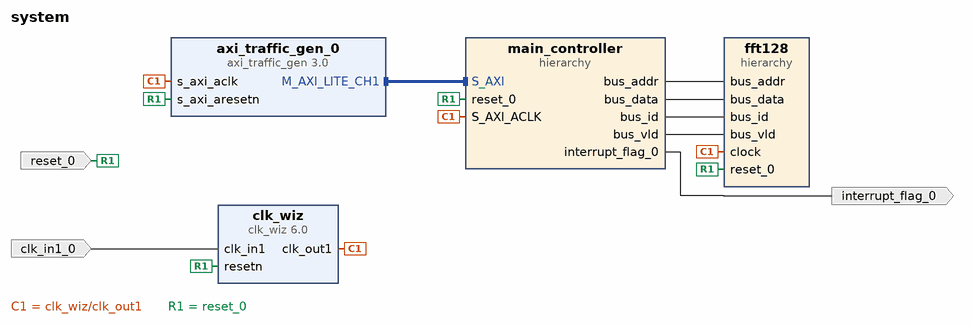
[diagram p0: block diagram of the top level]
# Vivado block design system, xc7z020clg484-1, Vivado 2018.3
create_bd_design system

create_bd_port -dir I -type rst reset_0
set_property -dict {CONFIG.POLARITY ACTIVE_LOW} [get_bd_ports reset_0]
create_bd_port -dir I -type clk clk_in1_0
create_bd_port -dir O interrupt_flag_0

create_bd_cell -type ip -vlnv xilinx.com:ip:axi_traffic_gen:3.0 axi_traffic_gen_0
set_property -dict [list \
  CONFIG.C_ATG_MIF_DATA_DEPTH 32 \
  CONFIG.C_ATG_MODE AXI4-Lite \
  CONFIG.C_ATG_SYSTEM_INIT_ADDR_MIF ../../../../../../../../mcs/coe/axi_lite_addr.coe \
  CONFIG.C_ATG_SYSTEM_INIT_DATA_MIF ../../../../../../../../mcs/coe/axi_lite_data.coe \
] [get_bd_cells axi_traffic_gen_0]
create_bd_cell -type ip -vlnv xilinx.com:ip:clk_wiz:6.0 clk_wiz
set_property -dict {CONFIG.RESET_PORT resetn CONFIG.RESET_TYPE ACTIVE_LOW} [get_bd_cells clk_wiz]
create_bd_cell -type hier fft128
create_bd_cell -type hier main_controller

# ---- hierarchy /fft128 ----
current_bd_instance /fft128
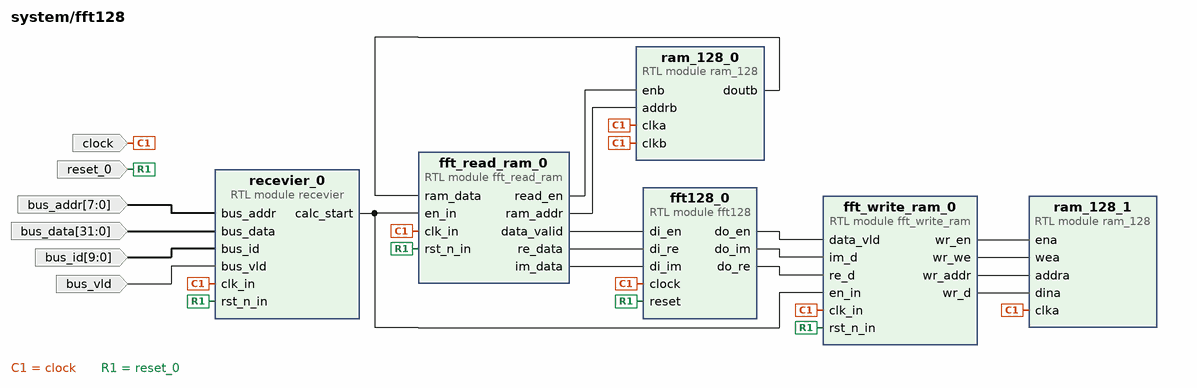
[diagram p1: block diagram inside /fft128]
create_bd_pin -dir I -type clk clock
create_bd_pin -dir I -type rst reset_0
create_bd_pin -dir I -from 7 -to 0 bus_addr
create_bd_pin -dir I -from 31 -to 0 bus_data
create_bd_pin -dir I -from 9 -to 0 bus_id
create_bd_pin -dir I bus_vld

create_bd_cell -type module -reference fft_read_ram fft_read_ram_0
set_property -dict {CONFIG.ARAMWIDTH 7} [get_bd_cells fft_read_ram_0]
create_bd_cell -type module -reference recevier recevier_0
create_bd_cell -type module -reference fft128 fft128_0
create_bd_cell -type module -reference fft_write_ram fft_write_ram_0
create_bd_cell -type module -reference ram_128 ram_128_0
create_bd_cell -type module -reference ram_128 ram_128_1

# ---- hierarchy /main_controller ----
current_bd_instance /main_controller
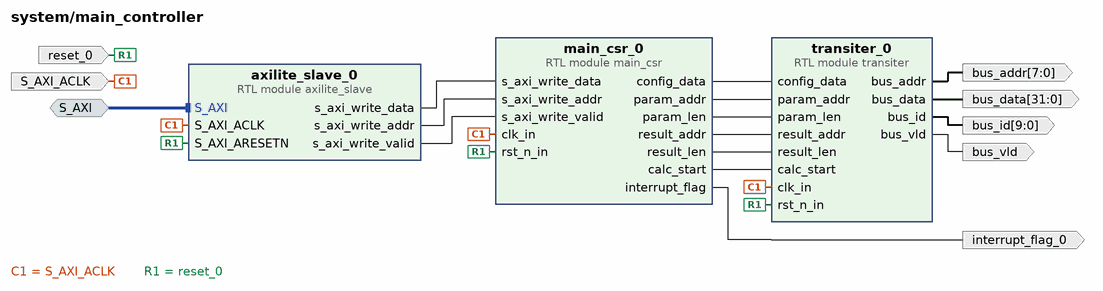
[diagram p2: block diagram inside /main_controller]
create_bd_intf_pin -mode Slave -vlnv xilinx.com:interface:aximm_rtl:1.0 S_AXI
create_bd_pin -dir I -type clk S_AXI_ACLK
create_bd_pin -dir I -type rst reset_0
create_bd_pin -dir O interrupt_flag_0
create_bd_pin -dir O -from 7 -to 0 bus_addr
create_bd_pin -dir O -from 31 -to 0 bus_data
create_bd_pin -dir O -from 9 -to 0 bus_id
create_bd_pin -dir O bus_vld

create_bd_cell -type module -reference axilite_slave axilite_slave_0
create_bd_cell -type module -reference main_csr main_csr_0
create_bd_cell -type module -reference transiter transiter_0

# ---- connections ----

current_bd_instance /fft128
connect_bd_net [get_bd_pins fft_write_ram_0/wr_en] [get_bd_pins ram_128_1/ena]
connect_bd_net [get_bd_pins fft_write_ram_0/wr_we] [get_bd_pins ram_128_1/wea]
connect_bd_net [get_bd_pins fft_write_ram_0/wr_addr] [get_bd_pins ram_128_1/addra]
connect_bd_net [get_bd_pins fft_write_ram_0/wr_d] [get_bd_pins ram_128_1/dina]
connect_bd_net [get_bd_pins fft128_0/do_en] [get_bd_pins fft_write_ram_0/data_vld]
connect_bd_net [get_bd_pins fft128_0/do_im] [get_bd_pins fft_write_ram_0/im_d]
connect_bd_net [get_bd_pins fft128_0/do_re] [get_bd_pins fft_write_ram_0/re_d]
connect_bd_net -net clk_wiz_clk_out1 [get_bd_pins clock] \
  [get_bd_pins fft_read_ram_0/clk_in] [get_bd_pins recevier_0/clk_in] [get_bd_pins fft128_0/clock] \
  [get_bd_pins fft_write_ram_0/clk_in] [get_bd_pins ram_128_0/clka] [get_bd_pins ram_128_0/clkb] [get_bd_pins ram_128_1/clka]
connect_bd_net [get_bd_pins fft_read_ram_0/data_valid] [get_bd_pins fft128_0/di_en]
connect_bd_net [get_bd_pins fft_read_ram_0/re_data] [get_bd_pins fft128_0/di_re]
connect_bd_net [get_bd_pins fft_read_ram_0/im_data] [get_bd_pins fft128_0/di_im]
connect_bd_net [get_bd_pins bus_addr] [get_bd_pins recevier_0/bus_addr]
connect_bd_net [get_bd_pins bus_data] [get_bd_pins recevier_0/bus_data]
connect_bd_net [get_bd_pins bus_id] [get_bd_pins recevier_0/bus_id]
connect_bd_net [get_bd_pins bus_vld] [get_bd_pins recevier_0/bus_vld]
connect_bd_net [get_bd_pins recevier_0/calc_start] [get_bd_pins fft_read_ram_0/en_in] [get_bd_pins fft_write_ram_0/en_in]
connect_bd_net -net reset_0_1 [get_bd_pins reset_0] \
  [get_bd_pins fft_read_ram_0/rst_n_in] [get_bd_pins recevier_0/rst_n_in] [get_bd_pins fft128_0/reset] \
  [get_bd_pins fft_write_ram_0/rst_n_in]
connect_bd_net [get_bd_pins fft_read_ram_0/read_en] [get_bd_pins ram_128_0/enb]
connect_bd_net [get_bd_pins fft_read_ram_0/ram_addr] [get_bd_pins ram_128_0/addrb]
connect_bd_net [get_bd_pins ram_128_0/doutb] [get_bd_pins fft_read_ram_0/ram_data]

current_bd_instance /main_controller
connect_bd_intf_net -intf_net axi_traffic_gen_0_M_AXI_LITE_CH1 [get_bd_intf_pins S_AXI] [get_bd_intf_pins axilite_slave_0/S_AXI]
connect_bd_net [get_bd_pins axilite_slave_0/s_axi_write_data] [get_bd_pins main_csr_0/s_axi_write_data]
connect_bd_net [get_bd_pins axilite_slave_0/s_axi_write_addr] [get_bd_pins main_csr_0/s_axi_write_addr]
connect_bd_net [get_bd_pins axilite_slave_0/s_axi_write_valid] [get_bd_pins main_csr_0/s_axi_write_valid]
connect_bd_net [get_bd_pins main_csr_0/config_data] [get_bd_pins transiter_0/config_data]
connect_bd_net [get_bd_pins main_csr_0/param_addr] [get_bd_pins transiter_0/param_addr]
connect_bd_net [get_bd_pins main_csr_0/param_len] [get_bd_pins transiter_0/param_len]
connect_bd_net [get_bd_pins main_csr_0/result_addr] [get_bd_pins transiter_0/result_addr]
connect_bd_net [get_bd_pins main_csr_0/result_len] [get_bd_pins transiter_0/result_len]
connect_bd_net [get_bd_pins main_csr_0/calc_start] [get_bd_pins transiter_0/calc_start]
connect_bd_net -net clk_wiz_clk_out1 [get_bd_pins S_AXI_ACLK] \
  [get_bd_pins axilite_slave_0/S_AXI_ACLK] [get_bd_pins main_csr_0/clk_in] [get_bd_pins transiter_0/clk_in]
connect_bd_net -net reset_0_1 [get_bd_pins reset_0] \
  [get_bd_pins axilite_slave_0/S_AXI_ARESETN] [get_bd_pins main_csr_0/rst_n_in] [get_bd_pins transiter_0/rst_n_in]
connect_bd_net [get_bd_pins main_csr_0/interrupt_flag] [get_bd_pins interrupt_flag_0]
connect_bd_net [get_bd_pins transiter_0/bus_addr] [get_bd_pins bus_addr]
connect_bd_net [get_bd_pins transiter_0/bus_data] [get_bd_pins bus_data]
connect_bd_net [get_bd_pins transiter_0/bus_id] [get_bd_pins bus_id]
connect_bd_net [get_bd_pins transiter_0/bus_vld] [get_bd_pins bus_vld]

current_bd_instance /
connect_bd_intf_net [get_bd_intf_pins axi_traffic_gen_0/M_AXI_LITE_CH1] [get_bd_intf_pins main_controller/S_AXI]
connect_bd_net [get_bd_pins clk_wiz/clk_out1] \
  [get_bd_pins axi_traffic_gen_0/s_axi_aclk] [get_bd_pins fft128/clock] [get_bd_pins main_controller/S_AXI_ACLK]
connect_bd_net -net reset_0_1 [get_bd_ports reset_0] \
  [get_bd_pins axi_traffic_gen_0/s_axi_aresetn] [get_bd_pins fft128/reset_0] [get_bd_pins main_controller/reset_0] \
  [get_bd_pins clk_wiz/resetn]
connect_bd_net -net clk_in1_0_1 [get_bd_ports clk_in1_0] [get_bd_pins clk_wiz/clk_in1]
connect_bd_net -net main_csr_0_interrupt_flag [get_bd_pins main_controller/interrupt_flag_0] [get_bd_ports interrupt_flag_0]
connect_bd_net -net transiter_0_bus_addr [get_bd_pins main_controller/bus_addr] [get_bd_pins fft128/bus_addr]
connect_bd_net -net transiter_0_bus_data [get_bd_pins main_controller/bus_data] [get_bd_pins fft128/bus_data]
connect_bd_net -net transiter_0_bus_id [get_bd_pins main_controller/bus_id] [get_bd_pins fft128/bus_id]
connect_bd_net -net transiter_0_bus_vld [get_bd_pins main_controller/bus_vld] [get_bd_pins fft128/bus_vld]

# ---- address map ----
assign_bd_address -offset 0x44A00000 -range 64K -target_address_space [get_bd_addr_spaces axi_traffic_gen_0/Reg1] [get_bd_addr_segs main_controller/axilite_slave_0/S_AXI/reg0]

validate_bd_design
save_bd_design
